# EAGLE design Dual Serial Card V2 (EAGLE 6.5.0)
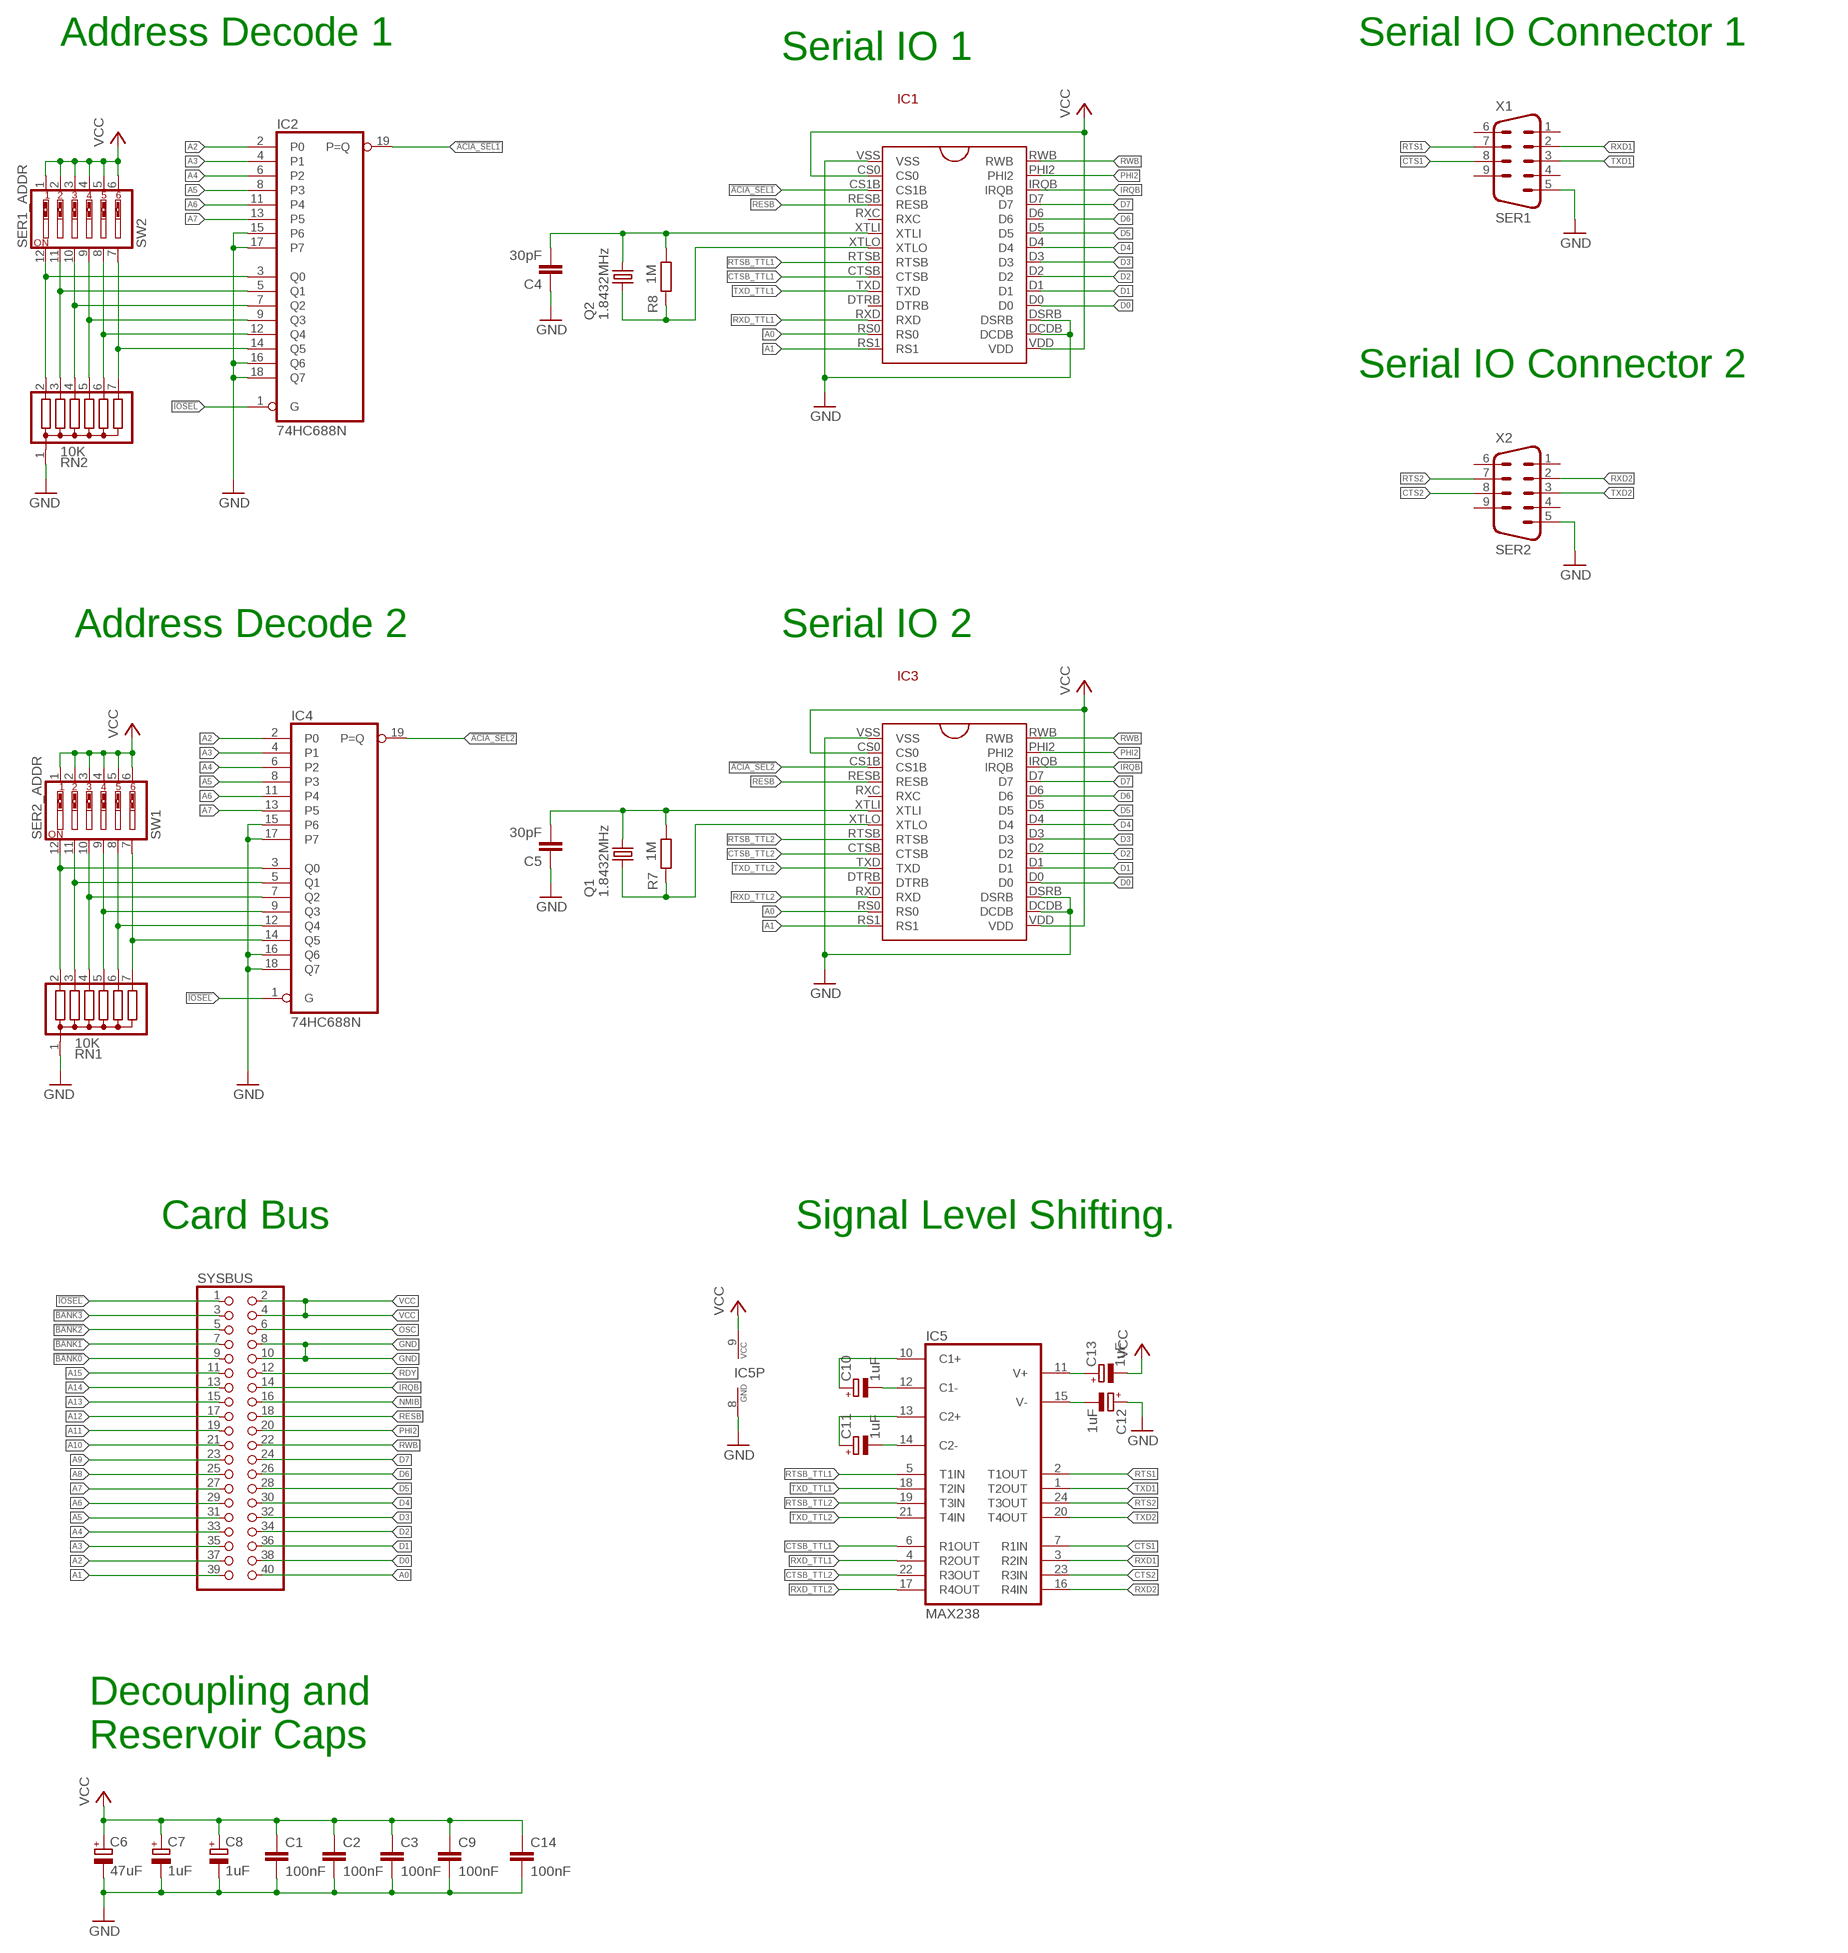
[diagram p0: schematic, sheet 1]

## Parts
C1  100nF  C-EU025-025X050  [C025-025X050]
C2  100nF  C-EU025-025X050  [C025-025X050]
C3  100nF  C-EU025-025X050  [C025-025X050]
C4  30pF  C-EU050-025X075  [C050-025X075]
C5  30pF  C-EU050-025X075  [C050-025X075]
C6  47uF  CPOL-EUE2.5-7  [E2,5-7]
C7  1uF  CPOL-EUE2.5-5  [E2,5-5]
C8  1uF  CPOL-EUE2.5-5  [E2,5-5]
C9  100nF  C-EU025-025X050  [C025-025X050]
C10  1uF  CPOL-EUE2.5-5  [E2,5-5]
C11  1uF  CPOL-EUE2.5-5  [E2,5-5]
C12  1uF  CPOL-EUE2.5-5  [E2,5-5]
C13  1uF  CPOL-EUE2.5-5  [E2,5-5]
C14  100nF  C-EU025-025X050  [C025-025X050]
IC1  W65C51N-DIP  [W65C51N-DIP]
IC2  74HC688N  [DIL20]
IC3  W65C51N-DIP  [W65C51N-DIP]
IC4  74HC688N  [DIL20]
IC5  MAX238  [DIL24-3]
Q1  1.8432MHz  CRYSTALHC49S  [HC49/S]
Q2  1.8432MHz  CRYSTALHC49S  [HC49/S]
R7  1M  R-EU_0207/2V  [0207/2V]
R8  1M  R-EU_0207/2V  [0207/2V]
RN1  10K  G06R  [SIL7]
RN2  10K  G06R  [SIL7]
SW1  SER2_ADDR  SW_DIP-6  [EDG-06]
SW2  SER1_ADDR  SW_DIP-6  [EDG-06]
SYSBUS  PINHD-2X20/90  [2X20/90]
X1  SER1  M09HP  [M09HP]
X2  SER2  M09HP  [M09HP]

## Nets
!ACIA_SEL1: IC1.CS1B IC2.19(P=Q)
!ACIA_SEL2: IC3.CS1B IC4.19(P=Q)
!BANK0: SYSBUS.9
!BANK1: SYSBUS.7
!BANK2: SYSBUS.5
!BANK3: SYSBUS.3
!IOSEL: IC2.1(G) IC4.1(G) SYSBUS.1
A0: IC1.RS0 IC3.RS0 SYSBUS.40
A1: IC1.RS1 IC3.RS1 SYSBUS.39
A2: IC2.2(P0) IC4.2(P0) SYSBUS.37
A3: IC2.4(P1) IC4.4(P1) SYSBUS.35
A4: IC2.6(P2) IC4.6(P2) SYSBUS.33
A5: IC2.8(P3) IC4.8(P3) SYSBUS.31
A6: IC2.11(P4) IC4.11(P4) SYSBUS.29
A7: IC2.13(P5) IC4.13(P5) SYSBUS.27
A8: SYSBUS.25
A9: SYSBUS.23
A10: SYSBUS.21
A11: SYSBUS.19
A12: SYSBUS.17
A13: SYSBUS.15
A14: SYSBUS.13
A15: SYSBUS.11
CTS1: IC5.7(R1IN) X1.8
CTS2: IC5.23(R3IN) X2.8
CTSB_TTL1: IC1.CTSB IC5.6(R1OUT)
CTSB_TTL2: IC3.CTSB IC5.22(R3OUT)
D0: IC1.D0 IC3.D0 SYSBUS.38
D1: IC1.D1 IC3.D1 SYSBUS.36
D2: IC1.D2 IC3.D2 SYSBUS.34
D3: IC1.D3 IC3.D3 SYSBUS.32
D4: IC1.D4 IC3.D4 SYSBUS.30
D5: IC1.D5 IC3.D5 SYSBUS.28
D6: IC1.D6 IC3.D6 SYSBUS.26
D7: IC1.D7 IC3.D7 SYSBUS.24
GND [power]: C1.2 C2.2 C3.2 C4.1 C5.1 C6.- C7.- C8.- C9.2 C12.+ C14.2 IC1.DCDB IC1.DSRB IC1.VSS IC2.15(P6) IC2.16(Q6) IC2.17(P7) IC2.18(Q7) IC3.DCDB IC3.DSRB IC3.VSS IC4.15(P6) IC4.16(Q6) IC4.17(P7) IC4.18(Q7) IC5.8(GND) RN1.1 RN2.1 SYSBUS.8 SYSBUS.10 X1.5 X2.5
IRQB: IC1.IRQB IC3.IRQB SYSBUS.14
N$1: C5.2 IC3.XTLI Q1.2 R7.2
N$2: IC3.XTLO Q1.1 R7.1
N$3: C4.2 IC1.XTLI Q2.2 R8.2
N$4: IC1.XTLO Q2.1 R8.1
N$5: IC4.14(Q5) RN1.7 SW1.7
N$6 [power]: C10.- IC5.12(C1-)
N$7 [power]: C10.+ IC5.10(C1+)
N$8 [power]: C11.- IC5.14(C2-)
N$9 [power]: C11.+ IC5.13(C2+)
N$10 [power]: C13.+ IC5.11(V+)
N$11 [power]: C12.- IC5.15(V-)
N$17: IC2.14(Q5) RN2.7 SW2.7
NMIB: SYSBUS.16
OSC: SYSBUS.6
P1: IC4.12(Q4) RN1.6 SW1.8
P2: IC4.9(Q3) RN1.5 SW1.9
P3: IC2.12(Q4) RN2.6 SW2.8
P4: IC2.9(Q3) RN2.5 SW2.9
P5: IC2.7(Q2) RN2.4 SW2.10
P6: IC2.5(Q1) RN2.3 SW2.11
P8: IC4.7(Q2) RN1.4 SW1.10
P9: IC4.5(Q1) RN1.3 SW1.11
PHI2: IC1.PHI2 IC3.PHI2 SYSBUS.20
RDY: SYSBUS.12
RESB: IC1.RESB IC3.RESB SYSBUS.18
RTS1: IC5.2(T1OUT) X1.7
RTS2: IC5.24(T3OUT) X2.7
RTSB_TTL1: IC1.RTSB IC5.5(T1IN)
RTSB_TTL2: IC3.RTSB IC5.19(T3IN)
RWB: IC1.RWB IC3.RWB SYSBUS.22
RXD1: IC5.3(R2IN) X1.2
RXD2: IC5.16(R4IN) X2.2
RXD_TTL1: IC1.RXD IC5.4(R2OUT)
RXD_TTL2: IC3.RXD IC5.17(R4OUT)
S1_A2: IC2.3(Q0) RN2.2 SW2.12
S2_A2: IC4.3(Q0) RN1.2 SW1.12
TXD1: IC5.1(T2OUT) X1.3
TXD2: IC5.20(T4OUT) X2.3
TXD_TTL1: IC1.TXD IC5.18(T2IN)
TXD_TTL2: IC3.TXD IC5.21(T4IN)
VCC [power]: C1.1 C2.1 C3.1 C6.+ C7.+ C8.+ C9.1 C13.- C14.1 IC1.CS0 IC1.VDD IC3.CS0 IC3.VDD IC5.9(VCC) SW1.1 SW1.2 SW1.3 SW1.4 SW1.5 SW1.6 SW2.1 SW2.2 SW2.3 SW2.4 SW2.5 SW2.6 SYSBUS.2 SYSBUS.4
Unconnected: IC1.DTRB IC1.RXC IC3.DTRB IC3.RXC X1.1 X1.4 X1.6 X1.9 X2.1 X2.4 X2.6 X2.9

## Notes on the sheet
- Address Decode 1 | Serial IO Connector 1
- Serial IO 1
- Serial IO Connector 2
- Address Decode 2 | Serial IO 2
- Card Bus | Signal Level Shifting.
- Decoupling and
  Reservoir Caps

## Power pins joined to a net without a drawn wire
GND: IC2.10(GND) IC4.10(GND)
VCC: IC2.20(VCC) IC4.20(VCC)

## Library data of the parts
C1-C5 C9 C14 = rcl:C-EU: CAPACITOR, European symbol
C6-C8 C10-C13 = rcl:CPOL-EU: POLARIZED CAPACITOR, European symbol
IC1 IC3 = WDC-parts:W65C51N-DIP: Asynchronous Communications Interface Adaptor.
IC2 IC4 = 74xx-eu:74*688: 8-bit MAGNITUDE/IDENTITY COMPARATOR, totem pole
IC5 = maxim:MAX238: RS232 TRANSEIVER
Q1 Q2 = crystal:CRYSTAL: CRYSTAL; OC_FARNELL: 1667008; OC_NEWARK: unknown
R7 R8 = rcl:R-EU_: RESISTOR, European symbol
RN1 RN2 = resistor-sil:G06R: SIL RESISTOR; OC_FARNELL: unknown; OC_NEWARK: unknown
SW1 SW2 = special:SW_DIP-6: DIP SWITCH
SYSBUS = pinhead:PINHD-2X20: PIN HEADER
X1 X2 = con-subd:M09: SUB-D; OC_FARNELL: unknown; OC_NEWARK: unknown

## Net classes
0 default: width 0.305 mm
1 power: width 0.508 mm

## Board
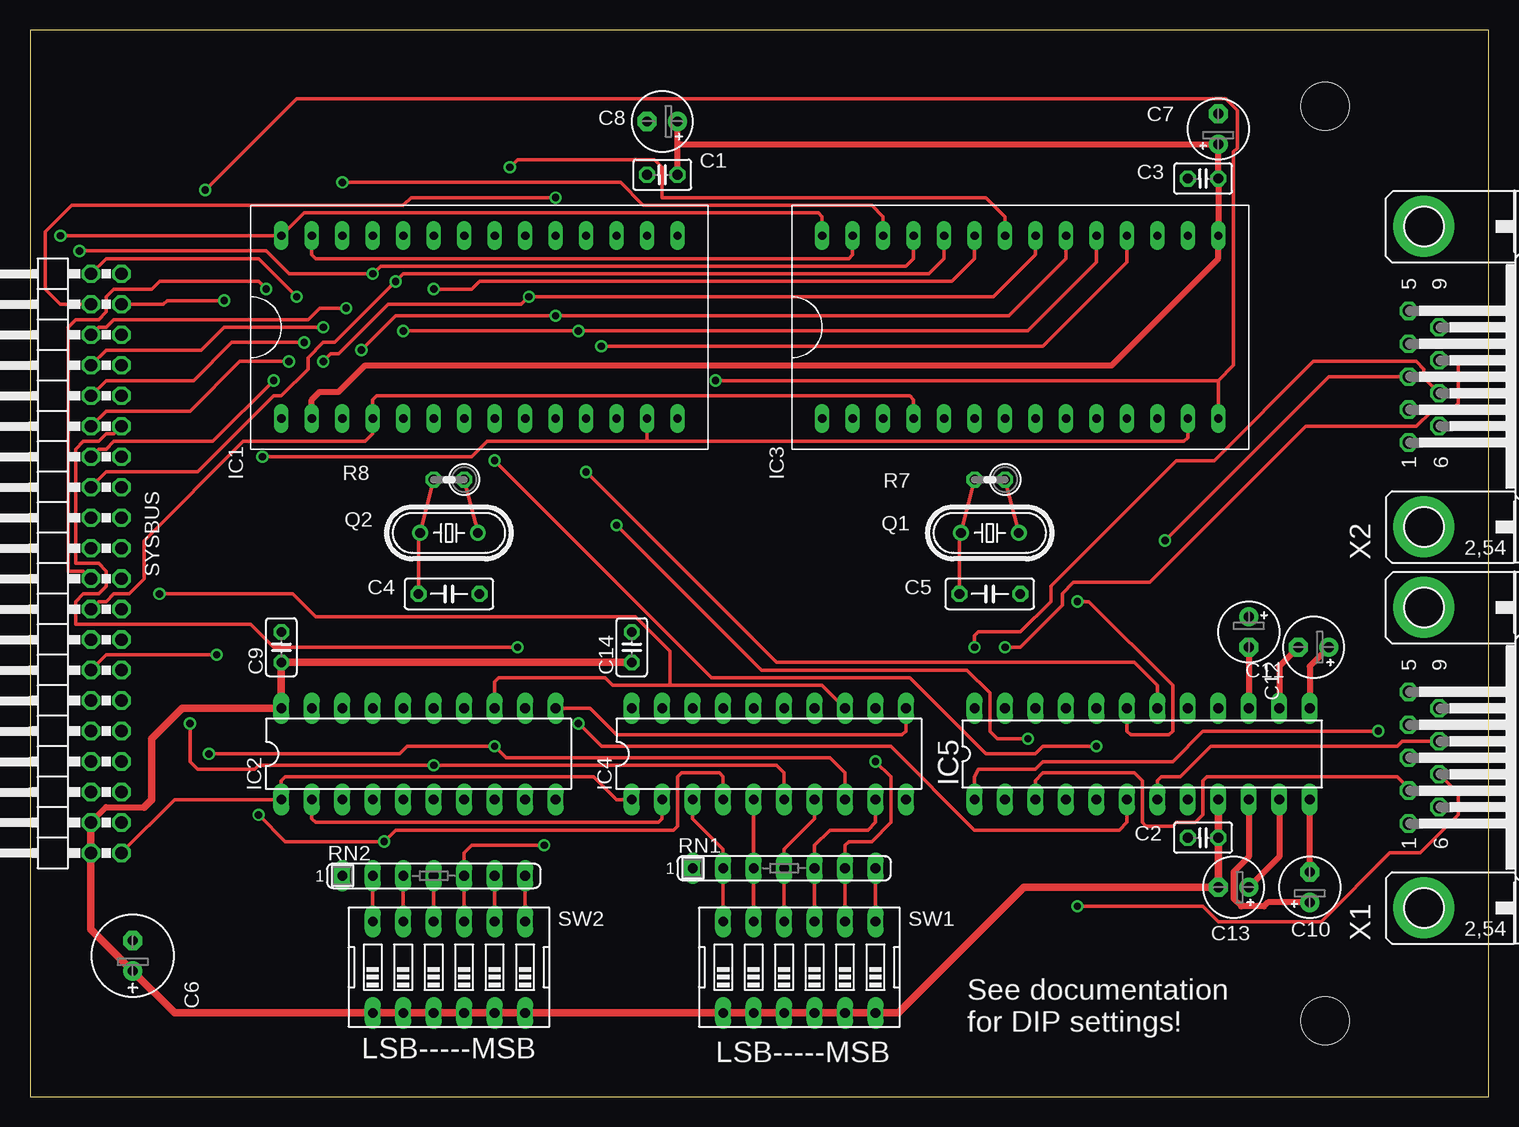
[diagram p1: board, top side]
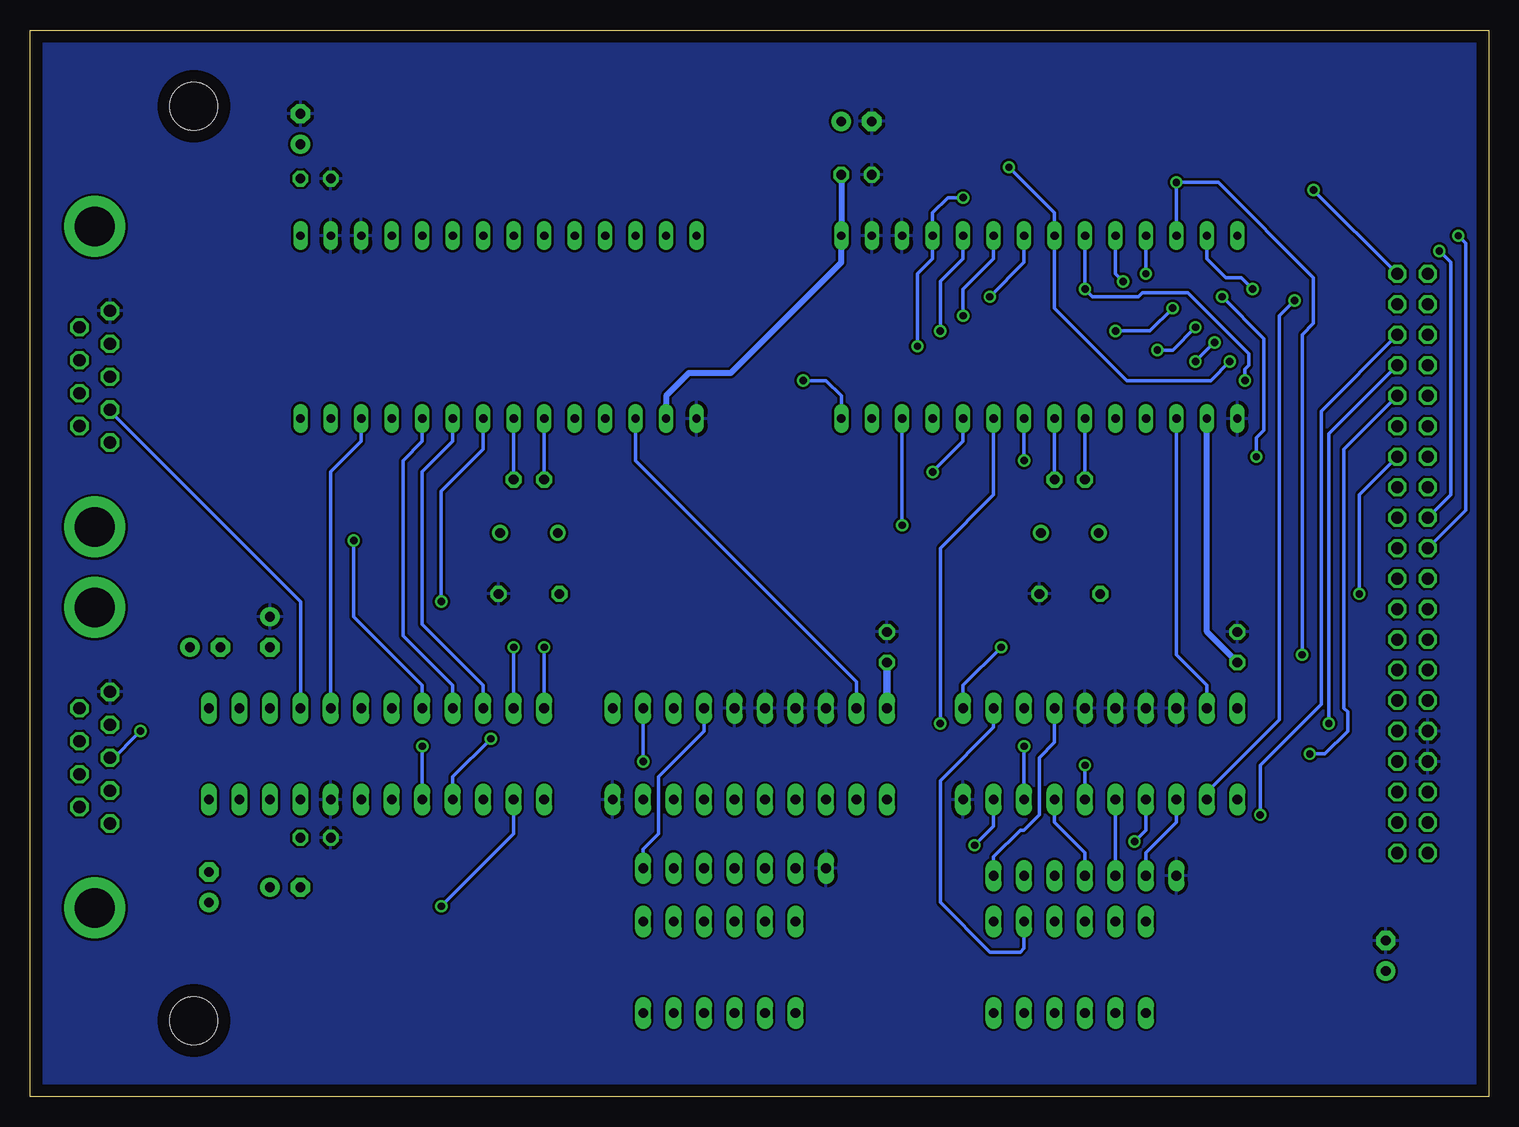
[diagram p2: board, bottom side, seen from below]

Size 121.6 x 88.9 mm. Coordinates in mm from the lower left corner, seen from the top.
Outline: 121.59,0 0,0 0,88.89 121.59,88.89
Outline: 121.6,0 121.6,88.9
Copper layers (1*16): Top 0.035mm / dielectric 1.5mm / Bottom 0.035mm
Design rules "default *": minimum track width 10mil, minimum drill 24mil, track to track 8mil, track to pad 8mil, pad to pad 8mil, via to via 8mil, smd to smd 8mil, copper to edge 40mil, drill to drill 8mil, minimum pad ring 10mil, minimum via ring 8mil, stop-mask expansion 4mil, vias tented up to drill 0mil, thermal gap 12mil
Holes 4 mm at 107.95,82.55 107.95,6.35

### Footprints (pad centres in the part's own frame; a part is rotated, then mirrored left to right if it is on the bottom)
C025-025X050 = drill 0.813 octagon: 1 -1.27,0; 2 1.27,0
C050-025X075 = drill 0.813 octagon: 1 -2.54,0; 2 2.54,0
E2,5-7 = drill 0.813 pad 1.6: + -1.27,0 | drill 0.813 pad 1.6 octagon: - 1.27,0
E2,5-5 = drill 0.813 pad 1.6: + -1.27,0 | drill 0.813 pad 1.6 octagon: - 1.27,0
W65C51N-DIP = drill 0.7 long: CS0 -7.62,13.97; CS1B -7.62,11.43; CTSB -7.62,-3.81; D0 7.62,-8.89; D1 7.62,-6.35; D2 7.62,-3.81; D3 7.62,-1.27; D4 7.62,1.27; D5 7.62,3.81; D6 7.62,6.35; D7 7.62,8.89; DCDB 7.62,-13.97; DSRB 7.62,-11.43; DTRB -7.62,-8.89; IRQB 7.62,11.43; PHI2 7.62,13.97; RESB -7.62,8.89; RS0 -7.62,-13.97; RS1 -7.62,-16.51; RTSB -7.62,-1.27; RWB 7.62,16.51; RXC -7.62,6.35; RXD -7.62,-11.43; TXD -7.62,-6.35; VDD 7.62,-16.51; VSS -7.62,16.51; XTLI -7.62,3.81; XTLO -7.62,1.27
DIL20 = drill 0.813 long: 1 -11.43,-3.81; 2 -8.89,-3.81; 3 -6.35,-3.81; 4 -3.81,-3.81; 5 -1.27,-3.81; 6 1.27,-3.81; 7 3.81,-3.81; 8 6.35,-3.81; 9 8.89,-3.81; 10 11.43,-3.81; 11 11.43,3.81; 12 8.89,3.81; 13 6.35,3.81; 14 3.81,3.81; 15 1.27,3.81; 16 -1.27,3.81; 17 -3.81,3.81; 18 -6.35,3.81; 19 -8.89,3.81; 20 -11.43,3.81
DIL24-3 = drill 0.813 long: 1 -13.97,-3.81; 2 -11.43,-3.81; 3 -8.89,-3.81; 4 -6.35,-3.81; 5 -3.81,-3.81; 6 -1.27,-3.81; 7 1.27,-3.81; 8 3.81,-3.81; 9 6.35,-3.81; 10 8.89,-3.81; 11 11.43,-3.81; 12 13.97,-3.81; 13 13.97,3.81; 14 11.43,3.81; 15 8.89,3.81; 16 6.35,3.81; 17 3.81,3.81; 18 1.27,3.81; 19 -1.27,3.81; 20 -3.81,3.81; 21 -6.35,3.81; 22 -8.89,3.81; 23 -11.43,3.81; 24 -13.97,3.81
HC49/S = drill 0.813: 1 -2.413,0; 2 2.413,0
0207/2V = drill 0.813 octagon: 1 -1.27,0; 2 1.27,0
SIL7 = drill 0.813 long: 1 -7.62,0; 2 -5.08,0; 3 -2.54,0; 4 0,0; 5 2.54,0; 6 5.08,0; 7 7.62,0
EDG-06 = drill 0.813 long: 1 -6.35,-3.81; 2 -3.81,-3.81; 3 -1.27,-3.81; 4 1.27,-3.81; 5 3.81,-3.81; 6 6.35,-3.81; 7 6.35,3.81; 8 3.81,3.81; 9 1.27,3.81; 10 -1.27,3.81; 11 -3.81,3.81; 12 -6.35,3.81
2X20/90 = drill 1.016 octagon: 1 -24.13,-6.35; 2 -24.13,-3.81; 3 -21.59,-6.35; 4 -21.59,-3.81; 5 -19.05,-6.35; 6 -19.05,-3.81; 7 -16.51,-6.35; 8 -16.51,-3.81; 9 -13.97,-6.35; 10 -13.97,-3.81; 11 -11.43,-6.35; 12 -11.43,-3.81; 13 -8.89,-6.35; 14 -8.89,-3.81; 15 -6.35,-6.35; 16 -6.35,-3.81; 17 -3.81,-6.35; 18 -3.81,-3.81; 19 -1.27,-6.35; 20 -1.27,-3.81; 21 1.27,-6.35; 22 1.27,-3.81; 23 3.81,-6.35; 24 3.81,-3.81; 25 6.35,-6.35; 26 6.35,-3.81; 27 8.89,-6.35; 28 8.89,-3.81; 29 11.43,-6.35; 30 11.43,-3.81; 31 13.97,-6.35; 32 13.97,-3.81; 33 16.51,-6.35; 34 16.51,-3.81; 35 19.05,-6.35; 36 19.05,-3.81; 37 21.59,-6.35; 38 21.59,-3.81; 39 24.13,-6.35; 40 24.13,-3.81
M09HP = drill 1.016 octagon: 1 -5.486,1.27; 2 -2.743,1.27; 3 0,1.27; 4 2.743,1.27; 5 5.486,1.27; 6 -4.115,-1.27; 7 -1.372,-1.27; 8 1.372,-1.27; 9 4.115,-1.27 | drill 3.302 pad 5.08: G1 -12.522,0; G2 12.522,0

### Placement (x,y rotation side)
C1  52.7,76.83 180 top
C2  97.79,21.59 180 top
C3  97.79,76.52 180 top
C4  34.92,41.91 180 top
C5  80.01,41.91 180 top
C6  8.57,11.75 90 top
C7  99.06,80.64 90 top
C8  52.7,81.28 180 top
C9  20.95,37.47 90 top
C10  106.68,17.46 90 top
C11  107,37.47 180 top
C12  101.6,38.73 270 top
C13  100.33,17.46 180 top
C14  50.16,37.47 90 top
IC1  37.47,64.14 90 top
IC2  32.38,28.57 0 top
IC3  82.55,64.14 90 top
IC4  61.59,28.57 0 top
IC5  92.71,28.57 0 top
Q1  80.01,46.99 180 top
Q2  34.92,46.99 180 top
R7  80.01,51.44 180 top
R8  34.92,51.44 180 top
RN1  62.87,19.05 0 top
RN2  33.66,18.41 0 top
SW1  64.14,10.79 0 top
SW2  34.92,10.79 0 top
SYSBUS  1.27,44.45 90 top
X1  116.2,28.26 90 top
X2  116.2,60.01 90 top

### Tracks (layer width: path | path; a pad name or v marks a point on that pad's centre or on a via)
!ACIA_SEL1
  Bottom 0.305: IC1.CS1B 26.04,36.83 23.5,34.29 IC2.19
!ACIA_SEL2
  Bottom 0.305: IC4.19 52.7,34.61 71.12,53.02 IC3.CS1B
!IOSEL
  Top 0.305: SYSBUS.1 12.06,24.77 IC2.1 20.95,26.35 21.27,26.67 46.99,26.67 48.9,24.77 IC4.1
A0  (via drill 0.61)
  Top 0.305: 51.44,54.61 IC1.RS0 | 51.44,54.61 96.2,54.61 96.52,54.93 IC3.RS0 | SYSBUS.40 6.35,69.85 19.05,69.85 v22.23,66.67 | v19.37,53.34 36.83,53.34 38.1,54.61 51.44,54.61
  Bottom 0.305: v22.23,66.67 18.73,63.18 18.73,55.56 19.37,54.93 v19.37,53.34
A1  (via drill 0.61)
  Top 0.305: 99.06,59.69 v57.15,59.69 | IC3.RS1 99.06,59.69 | v14.61,75.56 22.23,83.19 99.69,83.19 100.65,82.23 100.65,79.06 100.33,78.74 100.33,60.96 99.06,59.69
  Bottom 0.305: v57.15,59.69 55.24,59.69 53.98,58.42 IC1.RS1 | v14.61,75.56 SYSBUS.39
A2  (via drill 0.61)
  Top 0.305: IC2.2 23.5,23.18 23.81,22.86 52.39,22.86 52.7,23.18 IC4.2 | v16.19,66.36 11.43,66.36 11.11,66.04 SYSBUS.37
  Bottom 0.305: v16.19,66.36 17.46,65.09 17.46,31.43 23.5,25.4 IC2.2
A3  (via drill 0.61)
  Top 0.305: IC4.4 57.78,26.67 57.47,26.99 54.29,26.99 53.98,26.67 53.98,22.54 53.66,22.23 30.48,22.23 v29.53,21.27 21.27,21.27 v19.05,23.5
  Bottom 0.305: IC2.4 28.57,22.23 v29.53,21.27 | SYSBUS.35 13.97,57.15 13.97,32.7 19.05,27.62 v19.05,23.5
A4  (via drill 0.61)
  Top 0.305: IC4.6 62.87,26.99 62.23,27.62 v33.66,27.62 19.05,27.62 18.73,27.3 13.97,27.3 13.34,27.94 v13.34,31.11
  Bottom 0.305: v33.66,27.62 IC2.6 | SYSBUS.33 13.34,55.24 v13.34,31.11
A5  (via drill 0.61)
  Top 0.305: IC4.8 67.94,26.99 66.67,28.26 39.69,28.26 v38.73,29.21 31.43,29.21 30.8,28.57 v14.92,28.57
  Bottom 0.305: v38.73,29.21 IC2.8 | SYSBUS.31 12.06,53.98 12.06,32.38 11.75,32.07 11.75,30.48 13.65,28.57 v14.92,28.57
A6  (via drill 0.61)
  Top 0.305: IC2.11 46.67,32.38 48.9,30.16 72.71,30.16 73.03,30.48 IC4.11 | SYSBUS.29 6.99,55.24 6.35,55.24 5.71,54.61 4.45,54.61 3.81,53.98 3.81,44.45 5.71,44.45 6.35,43.81 6.35,42.55 5.71,41.91 4.45,41.91 3.81,41.27 3.81,39.37 18.41,39.37 20.32,37.47 v40.64,37.47
  Bottom 0.305: IC2.11 43.81,34.29 v40.64,37.47
A7  (via drill 0.61)
  Top 0.305: IC2.13 38.73,34.61 39.05,34.92 47.94,34.92 48.58,34.29 53.34,34.29 | 53.34,34.29 66.04,34.29 IC4.13 | v10.79,41.91 21.91,41.91 23.81,40.01 50.48,40.01 53.34,37.15 53.34,34.29
  Bottom 0.305: SYSBUS.27 10.79,50.16 v10.79,41.91
CTS1
  Top 0.305: IC5.7 93.98,26.35 94.3,26.67 95.89,26.67 98.42,29.21 113.98,29.21 114.4,29.63 X1.8
CTS2  (via drill 0.61)
  Top 0.305: v81.28,37.47 82.55,37.47 86.04,40.96 86.04,41.91 87,42.86 93.34,42.86 106.36,55.88 115.57,55.88 116.84,57.15 118.43,57.15 119.06,57.78 119.06,60.96 118.64,61.38 X2.8
  Bottom 0.305: v81.28,37.47 IC5.23
CTSB_TTL1  (via drill 0.61)
  Top 0.305: v45.72,31.11 47.62,29.21 71.75,29.21 78.74,22.23 90.81,22.23 91.44,22.86 IC5.6
  Bottom 0.305: v45.72,31.11 45.72,45.72 41.27,50.16 IC1.CTSB
CTSB_TTL2
  Bottom 0.305: IC3.CTSB 86.36,54.61 88.9,52.07 88.9,39.37 83.82,34.29 IC5.22
D0  (via drill 0.61)
  Top 0.305: v47.62,62.55 84.45,62.55 91.44,69.53 IC3.D0 | SYSBUS.38 2.54,66.04 1.27,67.31 1.27,72.07 3.49,74.3 31.11,74.3 31.75,74.93 v43.81,74.93
  Bottom 0.305: v47.62,62.55 47.62,68.58 46.35,69.85 IC1.D0 46.35,73.66 45.09,74.93 v43.81,74.93
D1  (via drill 0.61)
  Top 0.305: IC3.D1 88.9,69.53 83.19,63.82 v45.72,63.82 v31.11,63.82 | SYSBUS.36 5.71,64.14 6.35,64.14 6.99,64.77 23.18,64.77 24.13,65.72 v26.35,65.72
  Bottom 0.305: v45.72,63.82 45.72,67.94 43.81,69.85 IC1.D1 | v31.11,63.82 28.26,63.82 v26.35,65.72
D2  (via drill 0.61)
  Top 0.305: IC3.D2 86.36,69.85 81.6,65.09 v43.81,65.09 30.48,65.09 v27.62,62.23 | SYSBUS.34 6.35,62.23 14.29,62.23 16.19,64.14 v24.45,64.14
  Bottom 0.305: IC1.D2 41.27,69.85 43.81,67.31 v43.81,65.09 | v27.62,62.23 26.35,62.23 v24.45,64.14
D3  (via drill 0.61)
  Top 0.305: IC3.D3 83.82,70.17 80.33,66.67 v41.59,66.67 40.96,66.04 29.84,66.04 25.72,61.91 25.08,61.91 v24.45,61.28 | SYSBUS.32 6.35,59.69 13.65,59.69 16.83,62.87 v22.86,62.87
  Bottom 0.305: IC1.D3 38.73,69.53 v41.59,66.67 | v24.45,61.28 v22.86,62.87
D4  (via drill 0.61)
  Top 0.305: v40.01,77.47 40.64,78.11 52.07,78.11 52.7,77.47 52.7,74.93 79.69,74.93 81.28,73.34 IC3.D4 | SYSBUS.30 6.35,57.15 13.34,57.15 17.46,61.28 v21.59,61.28
  Bottom 0.305: v40.01,77.47 36.2,73.66 IC1.D4 36.2,65.72 30.16,59.69 23.18,59.69 v21.59,61.28
D5  (via drill 0.61)
  Top 0.305: v33.66,67.31 36.83,67.31 37.47,67.94 76.83,67.94 78.74,69.85 IC3.D5 | SYSBUS.28 5.71,53.98 6.35,53.98 6.99,54.61 15.24,54.61 v20.32,59.69
  Bottom 0.305: IC1.D5 v33.66,67.31 33.02,66.67 29.21,66.67 28.89,66.99 25.08,66.99 20,61.91 20,60.96 20.32,60.64 v20.32,59.69
D6  (via drill 0.61)
  Top 0.305: SYSBUS.26 6.35,52.07 13.97,52.07 20.32,58.42 20.95,58.42 23.18,60.64 23.18,61.59 24.45,62.87 25.4,62.87 v30.48,67.94 31.11,68.58 74.93,68.58 76.2,69.85 IC3.D6
  Bottom 0.305: IC1.D6 31.11,68.58 v30.48,67.94
D7  (via drill 0.61)
  Top 0.305: IC3.D7 73.66,69.85 73.03,69.22 29.21,69.22 v28.57,68.58 21.59,68.58 19.68,70.48 v4.13,70.48
  Bottom 0.305: v28.57,68.58 IC1.D7 | SYSBUS.24 3.17,50.16 3.17,69.53 v4.13,70.48
GND
  pour Bottom (isolate 0.203): 0,88.9 121.28,88.9 121.28,0 0,0
IRQB  (via drill 0.61)
  Top 0.305: v26.04,76.2 49.21,76.2 51.12,74.3 68.58,74.3 70.17,74.3 71.12,73.34 IC3.IRQB | SYSBUS.14 6.35,36.83 v15.56,36.83
  Bottom 0.305: IC1.IRQB v26.04,76.2 22.54,76.2 14.61,68.26 14.61,64.45 15.56,63.5 v15.56,36.83
N$1
  Top 0.305: C5.2 77.47,46.99 Q1.2 R7.2
  Bottom 0.305: R7.2 IC3.XTLI
N$2
  Top 0.305: R7.1 Q1.1
  Bottom 0.305: R7.1 IC3.XTLO
N$3
  Top 0.305: C4.2 32.38,46.99 Q2.2 R8.2
  Bottom 0.305: R8.2 IC1.XTLI
N$4
  Top 0.305: R8.1 Q2.1
  Bottom 0.305: R8.1 IC1.XTLO
N$5
  Top 0.305: RN1.7 SW1.7
  Bottom 0.305: IC4.14 65.41,30.48 69.22,26.67 69.22,21.91 70.48,20.64 RN1.7
N$6
  Top 0.508: C10.- IC5.12
N$7
  Top 0.508: C10.+ 103.19,16.19 102.87,15.88 100.97,15.88 100.33,16.51 100.33,18.73 101.6,20 IC5.10
N$8
  Top 0.508: IC5.14 104.14,35.88 C11.-
N$9
  Top 0.508: IC5.13 106.68,35.88 C11.+
N$10
  Top 0.508: IC5.11 104.14,20 C13.+
N$11
  Top 0.508: C12.- IC5.15
N$17
  Top 0.305: RN2.7 SW2.7
  Bottom 0.305: IC2.14 36.2,29.53 37.47,28.26 37.47,23.5 38.73,22.23 39.05,22.23 41.27,20 RN2.7
P1  (via drill 0.61)
  Top 0.305: SW1.8 RN1.6 67.94,20.95 68.26,21.27 70.17,21.27 71.75,22.86 71.75,26.67 v70.48,27.94
  Bottom 0.305: v70.48,27.94 IC4.12
P2
  Top 0.305: SW1.9 RN1.5 65.41,20.95 66.67,22.23 69.85,22.23 70.48,22.86 IC4.9
P3
  Top 0.305: RN2.6 SW2.8
  Bottom 0.305: IC2.12 41.27,30.8 45.72,26.35 45.72,16.19 41.59,12.06 39.05,12.06 38.73,12.38 SW2.8
P4  (via drill 0.61)
  Top 0.305: SW2.9 RN2.5 36.2,20.32 36.83,20.95 v42.86,20.95
  Bottom 0.305: v42.86,20.95 41.27,22.54 IC2.9
P5
  Top 0.305: RN2.4 SW2.10
  Bottom 0.305: IC2.7 36.2,22.86 33.66,20.32 RN2.4
P6
  Top 0.305: RN2.3 SW2.11
  Bottom 0.305: RN2.3 IC2.5
P8
  Top 0.305: SW1.10 RN1.4 62.87,20.64 65.41,23.18 IC4.7
P9
  Top 0.305: SW1.11 RN1.3 IC4.5
PHI2  (via drill 0.61)
  Top 0.305: IC1.PHI2 23.5,70.17 23.81,69.85 66.67,69.85 68.26,69.85 68.58,70.17 IC3.PHI2 | SYSBUS.20 4.45,43.81 3.17,43.81 3.17,64.14 3.81,64.77 5.71,64.77 6.35,65.41 6.35,66.67 6.99,67.31 10.16,67.31 10.79,67.94 19.05,67.94 v19.68,67.31
  Bottom 0.305: IC1.PHI2 23.5,69.85 21.91,68.26 20.64,68.26 v19.68,67.31
RESB
  Top 0.305: IC3.RESB 73.66,58.1 73.34,58.42 28.89,58.42 28.57,58.1 IC1.RESB 28.57,55.24 27.94,54.61 17.78,54.61 9.53,46.35 9.53,43.18 8.26,41.91 6.99,41.91 6.35,41.27 5.71,41.27 SYSBUS.18
RTS1  (via drill 0.61)
  Top 0.305: v87.31,15.88 97.79,15.88 99.06,14.61 107.63,14.61 113.35,20.32 115.89,20.32 119.06,23.5 119.06,25.3 X1.7
  Bottom 0.305: v87.31,15.88 81.28,21.91 IC5.2
RTS2  (via drill 0.61)
  Top 0.305: X2.7 116.52,59.59 116.52,60.01 116.2,60.33 116.2,60.64 115.57,61.28 107,61.28 98.74,53.02 95.57,53.02 85.09,42.55 85.09,41.27 82.55,38.73 79.06,38.73 78.74,38.42 v78.74,37.47
  Bottom 0.305: v78.74,37.47 IC5.24
RTSB_TTL1  (via drill 0.61)
  Top 0.305: v38.73,53.02 56.83,34.92 73.34,34.92 79.69,28.57 83.82,28.57 84.45,29.21 v88.9,29.21
  Bottom 0.305: v38.73,53.02 IC1.RTSB | IC5.5 v88.9,29.21
RTSB_TTL2  (via drill 0.61)
  Top 0.305: v87.31,41.27 88.27,41.27 95.25,34.29 95.25,30.48 94.93,30.16 91.76,30.16 91.44,30.48 IC5.19
  Bottom 0.305: IC3.RTSB 83.82,53.98 87.31,50.48 v87.31,41.27
RWB  (via drill 0.61)
  Top 0.305: IC3.RWB 66.04,73.34 65.72,73.66 64.14,73.66 22.86,73.66 IC1.RWB v2.54,71.75
  Bottom 0.305: SYSBUS.22 1.91,48.9 1.91,71.12 v2.54,71.75
RXD1
  Top 0.305: IC5.3 83.82,26.35 84.45,26.99 92.08,26.99 92.71,26.35 92.71,22.86 93.03,22.54 95.25,22.54 95.57,22.86 97.16,22.86 97.79,23.5 97.79,26.35 98.11,26.67 113.98,26.67 114.94,25.72 X1.2
RXD2
  Bottom 0.305: X2.2 114.94,57.15 99.06,41.27 IC5.16
RXD_TTL1  (via drill 0.61)
  Top 0.305: v48.9,47.62 60.96,35.56 78.11,35.56 80.01,33.66 80.01,30.48 80.64,29.84 v83.19,29.84
  Bottom 0.305: v48.9,47.62 IC1.RXD | v83.19,29.84 86.36,26.67 IC5.4
RXD_TTL2
  Bottom 0.305: IC3.RXD 93.98,54.61 96.52,52.07 IC5.17
S1_A2
  Top 0.305: RN2.2 SW2.12
  Bottom 0.305: IC2.3 26.04,22.86 28.57,20.32 RN2.2
S2_A2
  Top 0.305: SW1.12 RN1.2 57.78,20.64 55.24,23.18 IC4.3
TXD1  (via drill 0.61)
  Top 0.305: IC5.1 78.74,26.67 79.06,27.3 83.82,27.3 84.45,27.94 95.25,27.94 97.79,30.48 v112.39,30.48
  Bottom 0.305: v112.39,30.48 114.94,27.94 X1.3
TXD2  (via drill 0.61)
  Top 0.305: v94.61,46.35 108.27,60.01 X2.3
  Bottom 0.305: v94.61,46.35 94.61,40.01 88.9,34.29 IC5.20
TXD_TTL1  (via drill 0.61)
  Top 0.305: v46.35,52.07 62.23,36.2 92.08,36.2 93.98,34.29 IC5.18
  Bottom 0.305: IC1.TXD 43.81,54.61 v46.35,52.07
TXD_TTL2
  Bottom 0.305: IC3.TXD 88.9,54.61 90.49,53.02 90.49,38.42 86.36,34.29 IC5.21
VCC
  Top 0.508: C1.1 53.98,79.38 | 53.98,79.38 C8.+ | 53.98,79.38 C7.+ C3.1 IC3.VDD 99.06,69.85 90.17,60.96 27.94,60.96 25.72,58.74 24.13,58.74 23.5,58.1 IC1.CS0 | 9.53,24.13 6.35,24.13 SYSBUS.4
  Top 0.61: C14.1 C9.1 IC2.20 12.7,32.38 10.16,29.84 10.16,24.77 9.53,24.13 | SYSBUS.4 SYSBUS.2 5.08,13.97 C6.+ 12.06,6.99 SW2.1 SW2.2 SW2.3 SW2.4 SW2.5 SW2.6 SW1.1 SW1.2 SW1.3 SW1.4 SW1.5 SW1.6 72.39,6.99 82.87,17.46 C13.- C2.1 IC5.9
  Bottom 0.508: C1.1 IC1.VDD 53.98,69.53 63.18,60.33 66.67,60.33 68.58,58.42 IC3.CS0 | IC1.CS0 23.5,38.73 C9.1
  Bottom 0.61: C14.1 IC4.20

### Text on the board
tNames: See documentation / for DIP settings! | LSB-----MSB | LSB-----MSB